# EasyEDA schematic Sheet_2.json
TITLE: Trainer and Bluetooth; REV: 1.0; Date: 2025-05-24; Sheet: 2/4; Drawn By: ILIAS ILIOPOULOS; Company: fryktoria.com
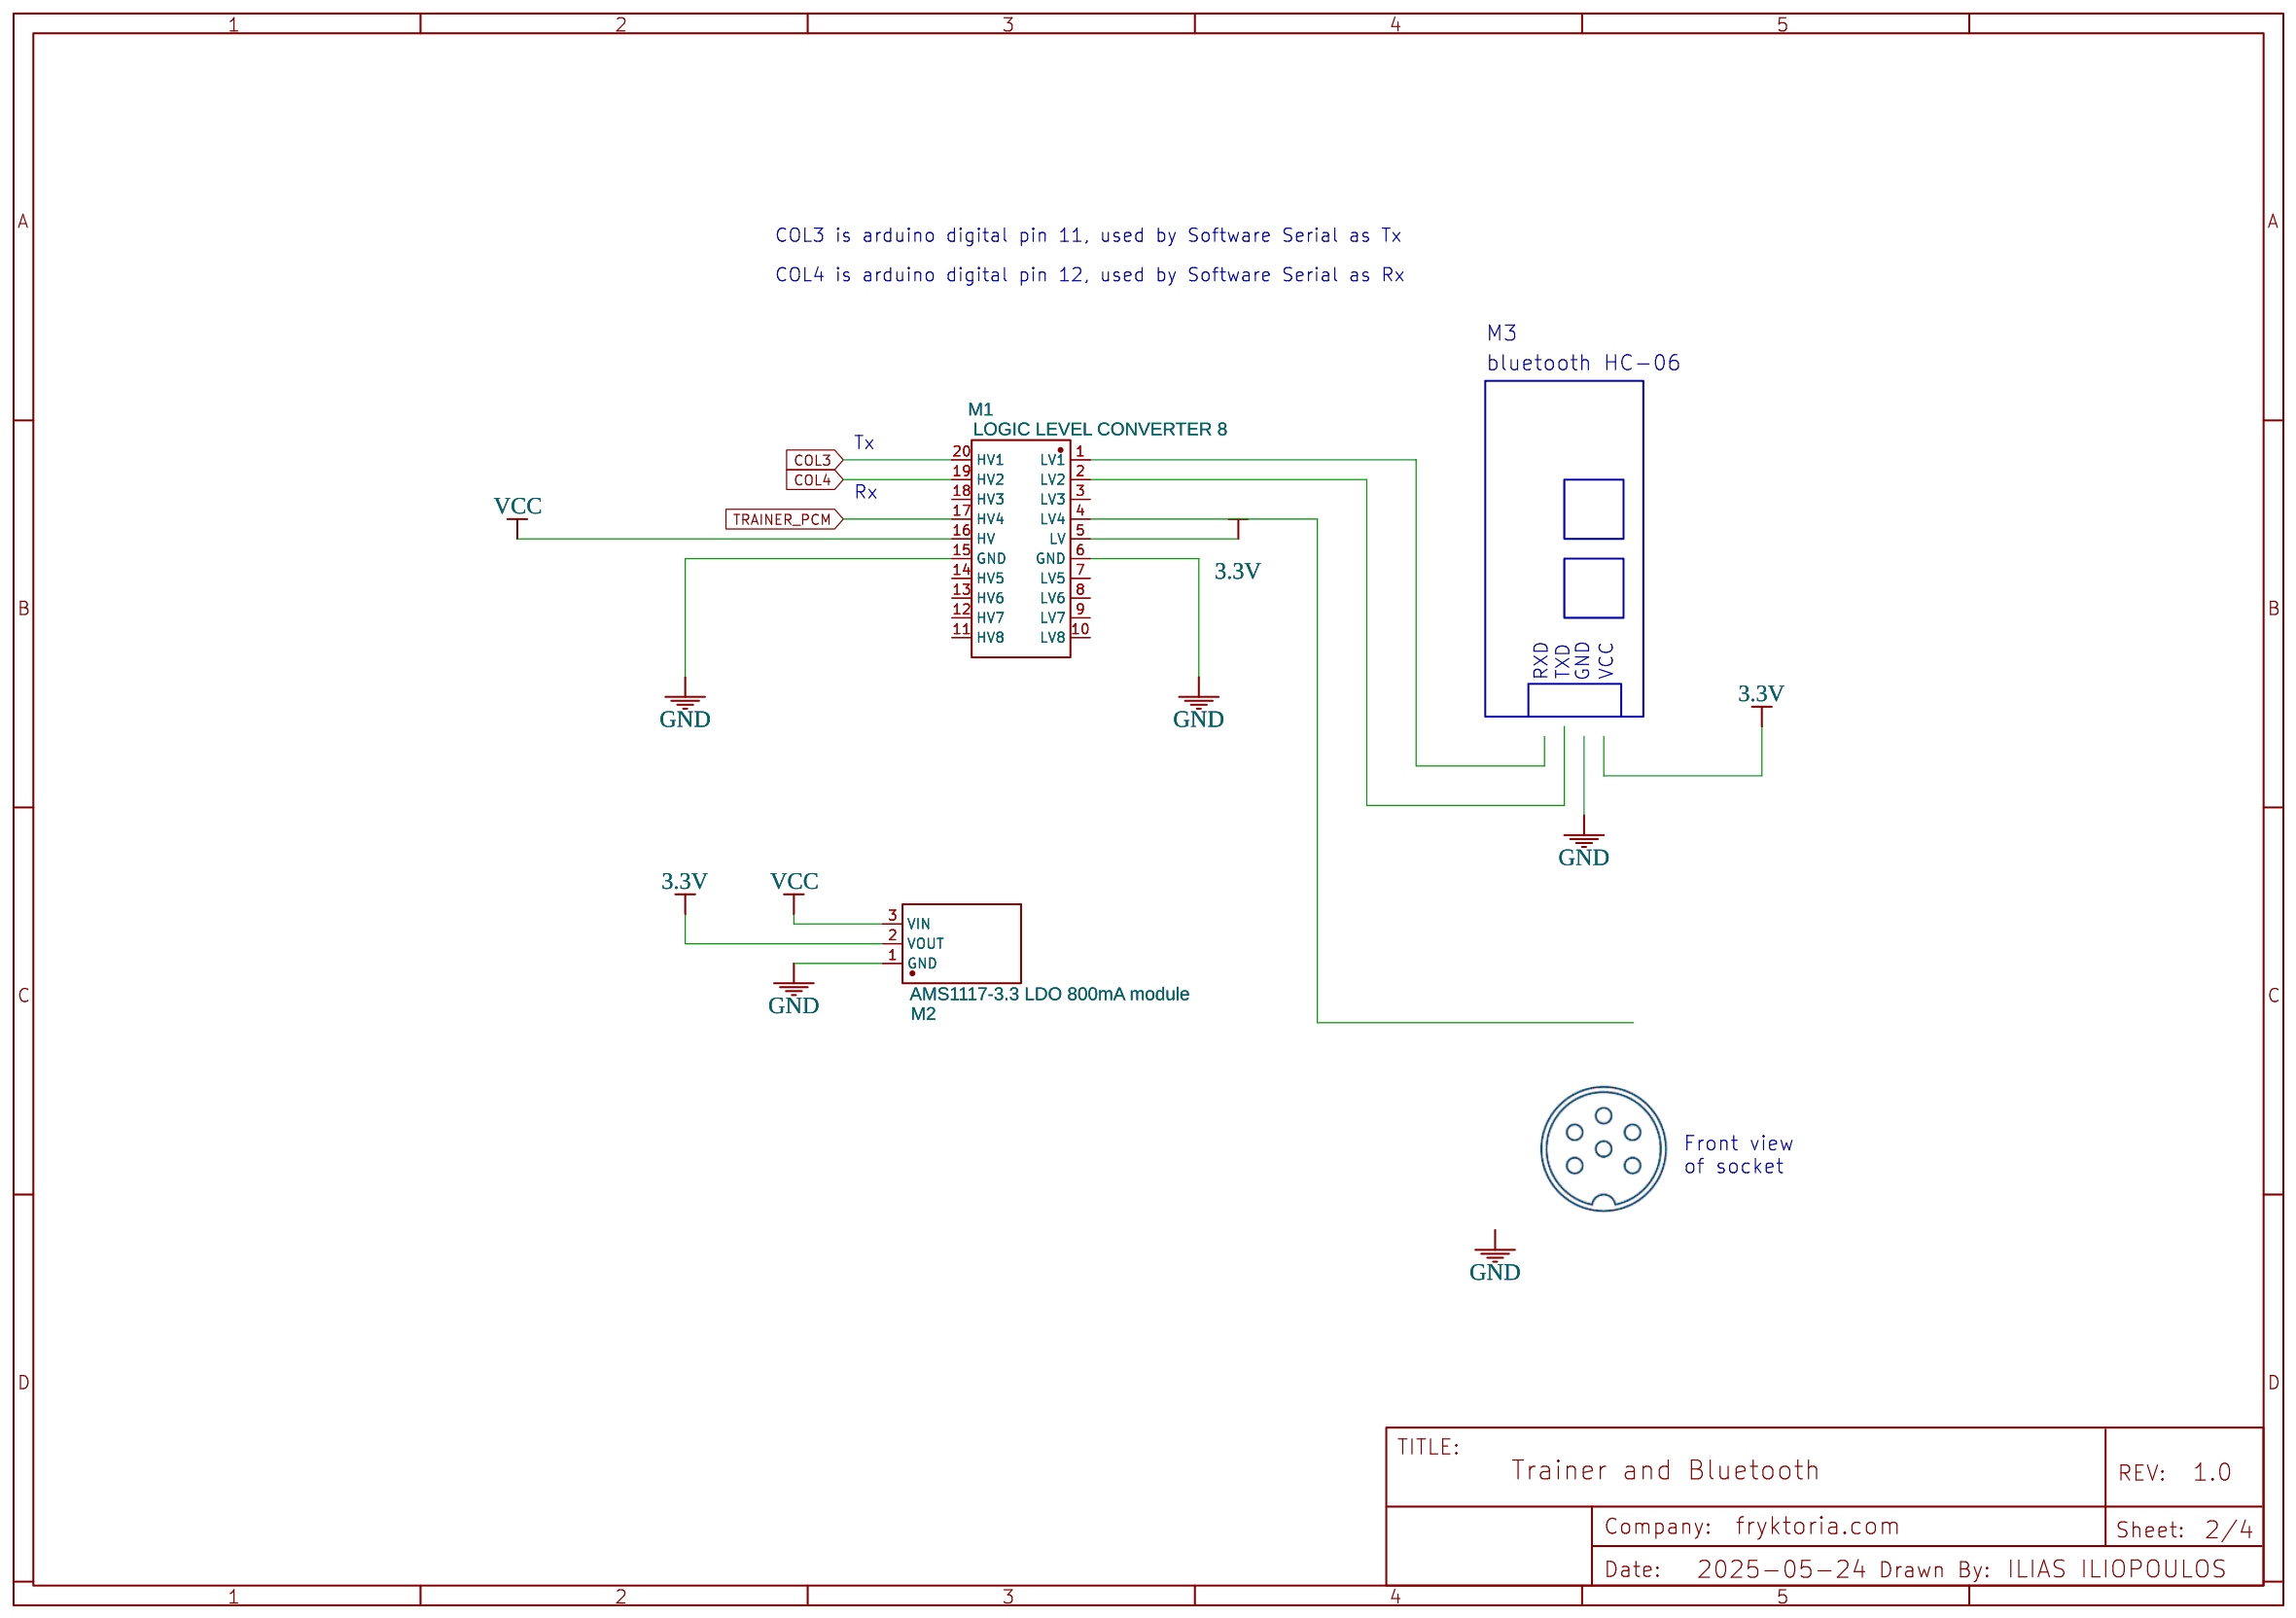
[diagram p0: schematic sheet]

## Parts
M1  LOGIC LEVEL CONVERTER 8  [MPN-TH-20_L28.0-W14.0-P2.54-BL]
M2  AMS1117-3.3 LDO 800mA module  [SOT-89-3_L4.5-W2.5-P1.50-LS4.2-BR]

## Library data of the parts
M1 = LEVEL CONVERTER 8: Contributor: LCSC; Supplier: LCSC; Supplier Part: C2829587; Manufacturer: null; Manufacturer Part: Level Converter 8; JLCPCB Part Class: Extended Part
M2 = AMS1117-3.3_C6067465: Supplier: LCSC; Supplier Part: C6067465; Manufacturer: GOODWORK(固得沃克); Manufacturer Part: AMS1117-3.3; Contributor: lcsc; JLCPCB Part Class: Extended Part

## Nets
3.3V: M1.5(LV) M2.2(VOUT)
GND: M1.6(GND) M1.15(GND) M2.1(GND)
VCC: M1.16(HV) M2.3(VIN)
COL3: M1.20(HV1)
COL4: M1.19(HV2)
TRAINER_PCM: M1.17(HV4)

Not connected (* = marked no-connect by the designer): M1 1(LV1) 2(LV2) 3(LV3) 4(LV4) 7(LV5) 8(LV6) 9(LV7) 10(LV8) 11(HV8) 12(HV7) 13(HV6) 14(HV5) 18(HV3)

## Notes on the sheet
- COL3 is arduino digital pin 11, used by Software Serial as Tx
- COL4 is arduino digital pin 12, used by Software Serial as Rx
- M3
- bluetooth HC-06
- Tx
- Rx
- RXD
- TXD
- GND
- VCC
- Front view
  of socket
